# Altium schematic sheet MAX30105.SchDoc
size A
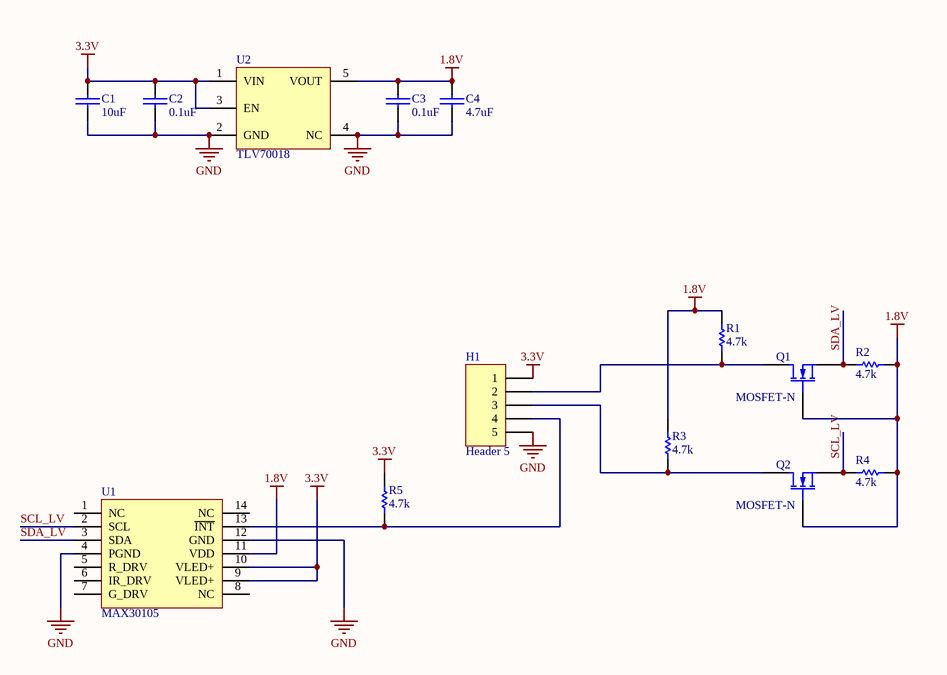
[diagram p0: MAX30105.SchDoc]

## Parts
C1  10uF  [0402[IMP]]
C2  0.1uF  [0402[IMP]]
C3  0.1uF  [0402[IMP]]
C4  4.7uF  [0402[IMP]]
H1  Header 5  [I2C_Header]
Q1  MOSFET-N  [SOT23]
Q2  MOSFET-N  [SOT23]
R1  4.7k  [0402[IMP]]
R2  4.7k  [0402[IMP]]
R3  4.7k  [0402[IMP]]
R4  4.7k  [0402[IMP]]
R5  4.7k  [0402[IMP]]
U1  MAX30105  [OLGA-14]
U2  TLV70018  [SC70-5pin]

## Nets
1.8V: C3.1 C4.1 Q1.2(G) Q2.2(G) R1.2 R2.1 R3.2 R4.1 U1.11(VDD) U2.5(VOUT)
3.3V: C1.1 C2.1 H1.1 R5.2 U1.9(VLED+) U1.10(VLED+) U2.1(VIN) U2.3(EN)
GND: C1.2 C2.2 C3.2 C4.2 H1.5 U1.4(PGND) U1.12(GND) U2.2(GND) U2.4(NC)
SCL_LV: Q2.3(S) R4.2 U1.2(SCL)
SDA_LV: Q1.3(S) R2.2 U1.3(SDA)
NetH1_2: H1.2 Q1.1(D) R1.1
NetH1_3: H1.3 Q2.1(D) R3.1
NetH1_4: H1.4 R5.1 U1.13(~{INT})

Not connected (* = marked no-connect by the designer): U1 1(NC) 5(R_DRV) 6(IR_DRV) 7(G_DRV) 8(NC) 14(NC)

## Library data of the parts
C1-C4 = CAPACITOR: VOLTAGE: CMAX; CURRENT: CIMAX; KNEE: CBMAX; PSpiceTemplate: C^@REFDES %1 %2 ?TOLERANCE|C^@REFDES| @VALUE ?IC/IC=@IC/ TC=@TC1,@TC2 ?TOLERANCE|\n.model C^@REFDES CAP C=1 DEV=@TOLERANCE%|; DIST: FLAT; SLOPE: CSMAX; MAX_TEMP: CTMAX; TC1: 0; CLASS: DISCRETE; TC2: 0; Supplier 1: Digi-Key
  C1: Value: 10uF; Supplier Part Number 1: 587-3237-1-ND
  C2 C3: Value: 0.1uF; Supplier Part Number 1: 490-3261-1-ND
  C4: Value: 4.7uF; Supplier Part Number 1: 445-5947-1-ND
Q1 Q2 = MOSFET-N: N-Channel MOSFET; Published: 8-Jun-2000; LatestRevisionDate: 17-Jul-2002; LatestRevisionNote: Re-released for DXP Platform.; PackageVersion: 1995/1996; PackageReference: E3; Publisher: Altium Limited; PackageDescription: TO, Flat Index; 3 In-Line, Axial Leads; Body Dia. 4.6mm; Lead Dia. 0.5 mm (max); Supplier 1: Digi-Key; Supplier Part Number 1: BSS138-FDICT-ND
R1-R5 = RESISTOR: Value: 4.7k; Supplier 1: Digi-Key; Supplier Part Number 1: P4.7KJCT-ND
U2 = SP6214: Supplier 1: Digi-Key; Supplier Part Number 1: 296-32409-1-ND
U1 = MAX30105: Supplier 1: Digi-Key; Supplier Part Number 1: MAX30105EFD+TCT-ND